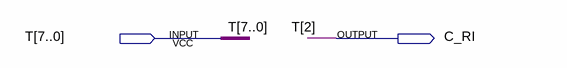
[diagram p0: schematic sheet]
// Quartus schematic C_RI.bdf as structural Verilog: 0 symbols, 2 pins
module C_RI (
  input  [7:0] T,
  output C_RI
);


  assign C_RI = T[2];
endmodule
